# Altium schematic sheet Esquematico Deck - Crazyflie V2.schdoc
size 232 x 93 mm
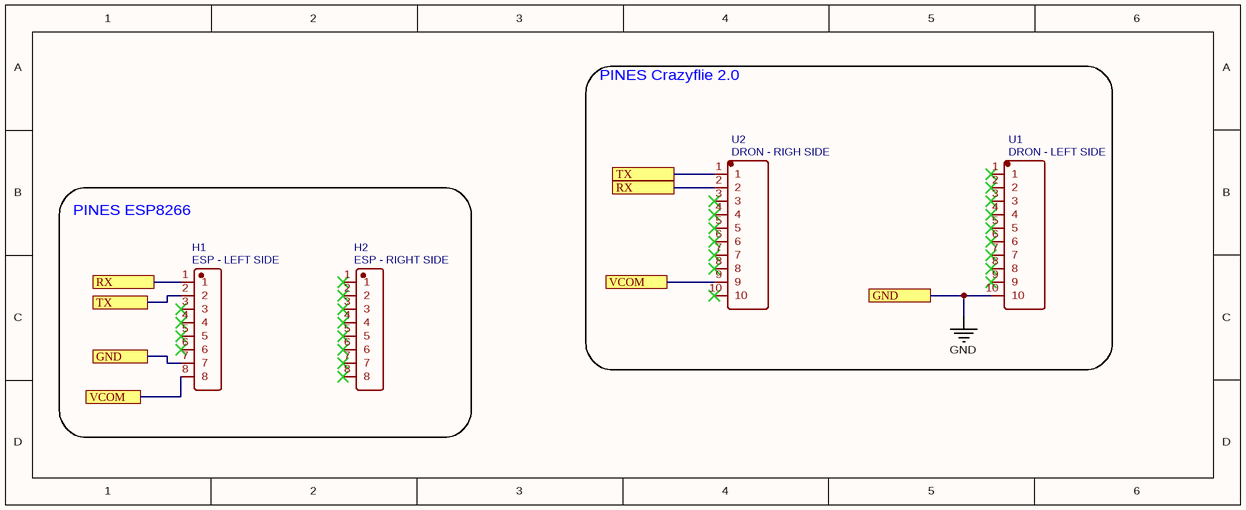
[diagram p0: Esquematico Deck - Crazyflie V2.schdoc]

## Parts
H1  ESP - LEFT SIDE  [HDR1X8]
H2  ESP - RIGHT SIDE  [HDR1X8]
U1  DRON - LEFT SIDE  [HDR1X10]
U2  DRON - RIGH SIDE  [HDR1X10]

## Blocks framed on the sheet
PINES Crazyflie 2.0: U1 U2
PINES ESP8266: H1 H2

## Ports
GND, RX, TX, VCOM

## Nets
GND: H1.7 U1.10 ; port GND
RX: H1.1 U2.2 ; port RX
TX: H1.2 U2.1 ; port TX
VCOM: H1.8 U2.9 ; port VCOM

Not connected (* = marked no-connect by the designer): H1 3* 4* 5* 6*; H2 1* 2* 3* 4* 5* 6* 7* 8*; U1 1* 2* 3* 4* 5* 6* 7* 8* 9*; U2 3* 4* 5* 6* 7* 8* 10*

## Library data of the parts
H1 = ESP - LEFT SIDE: BOM_Manufacturer: DEALON(德艺隆); BOM_Manufacturer Part: DZ254R-11-08-63; Contributor: LCSC; BOM_Supplier: LCSC; BOM_Supplier Part: C2935914; BOM_JLCPCB Part Class: Extended Part; spicePre: H; spiceSymbolName: DZ254R-11-08-63
H2 = ESP - RIGHT SIDE: BOM_Manufacturer: DEALON(德艺隆); BOM_Manufacturer Part: DZ254R-11-08-63; Contributor: LCSC; BOM_Supplier: LCSC; BOM_Supplier Part: C2935914; BOM_JLCPCB Part Class: Extended Part; spicePre: H; spiceSymbolName: DZ254R-11-08-63
U1 = DRON - LEFT SIDE: BOM_Manufacturer: 华宇创; BOM_Manufacturer Part: 2543U-110CNG1SNT01; Contributor: LCSC; BOM_Supplier: LCSC; BOM_Supplier Part: C350282; BOM_JLCPCB Part Class: Extended Part; spicePre: U; spiceSymbolName: 2543U-110CNG1SNT01
U2 = DRON - RIGH SIDE: BOM_Manufacturer: 华宇创; BOM_Manufacturer Part: 2543U-110CNG1SNT01; Contributor: LCSC; BOM_Supplier: LCSC; BOM_Supplier Part: C350282; BOM_JLCPCB Part Class: Extended Part; spicePre: U; spiceSymbolName: 2543U-110CNG1SNT01